# EasyEDA Pro project ProPrj_Sierra Wireless M2 Carrier_2026-07-14.epro

# Schematic Schematic1
Board Name: Board1; Create Date: 2026-07-10; Page Name: P1; Project Name: Sierra Wireless M2 Carrier; Schematic Name: Schematic1; Update Date: 2026-07-10; Company: EasyEDA.com; Page Size: A4; Version: V1.0
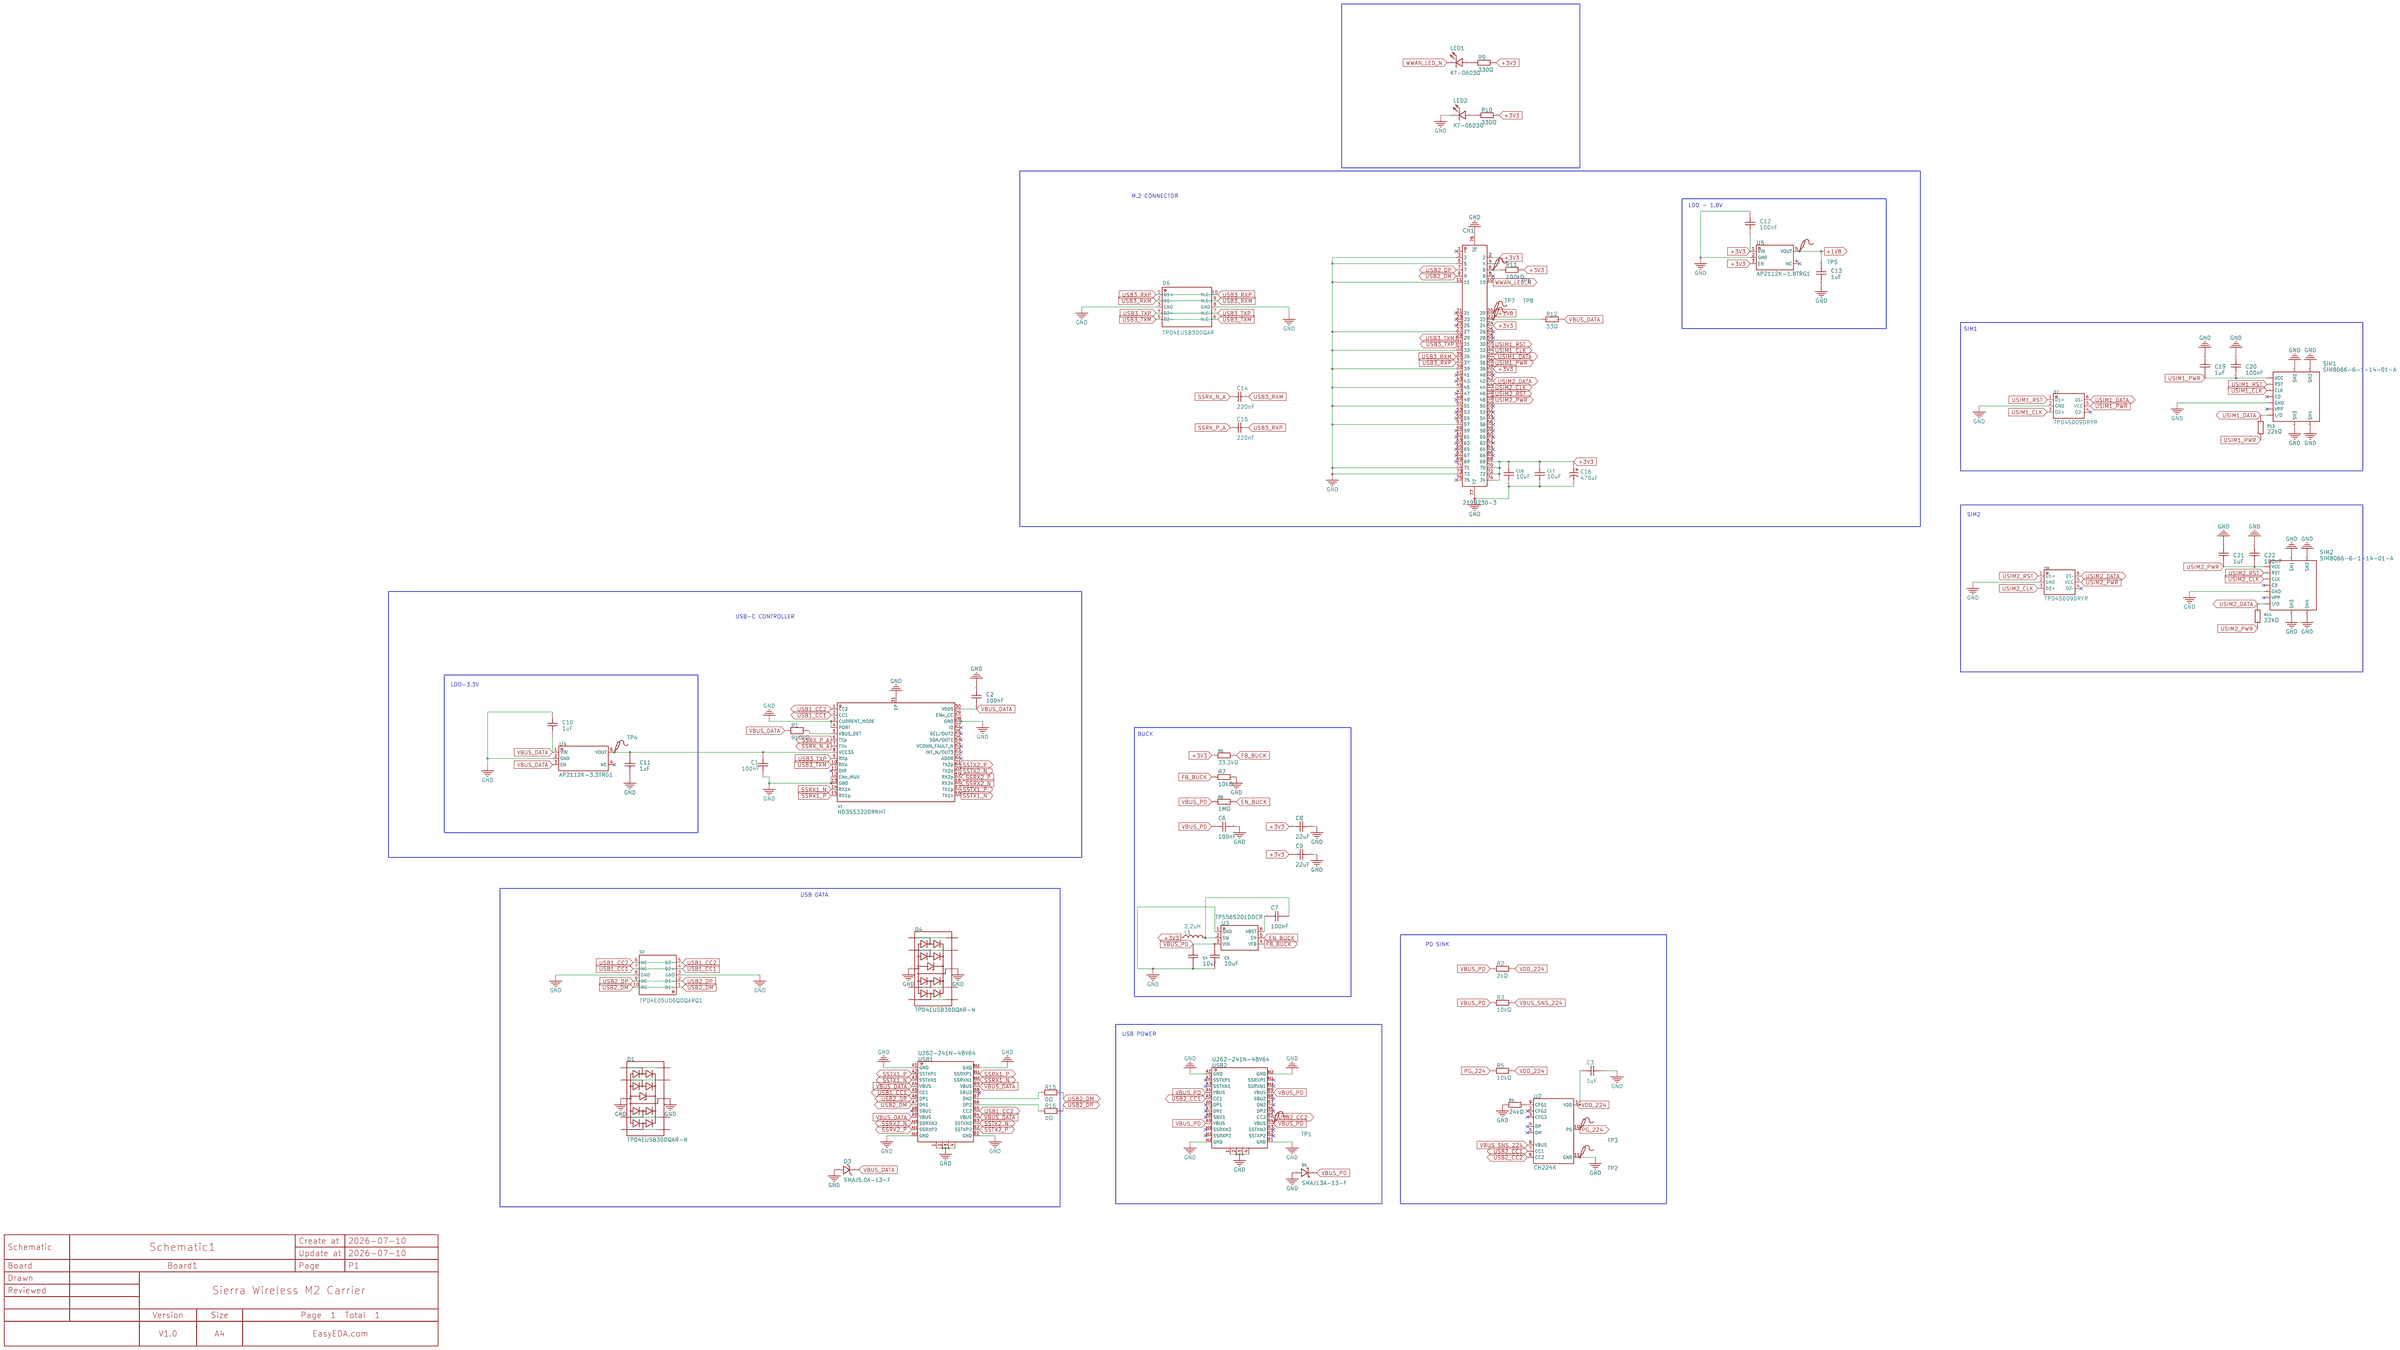
[diagram p0: schematic sheet]

## Parts
C1  100nF  [C0603]
C2  100nF  [C0603]
C3  1uF  [C0603]
C4  10uF  [C0603]
C5  10uF  [C0603]
C6  100nF  [C0402]
C7  100nF  [C0402]
C8  22uF  [C0603]
C9  22uF  [C0603]
C10  1uF  [C0603]
C11  1uF  [C0603]
C12  100nF  [C0402]
C13  1uF  [C0603]
C14  220nF  [C0603]
C15  220nF  [C0603]
C16  470uF  [CAP-TH_BD8.0-P3.50-D0.5-FD]
C17  10uF  [C0603]
C18  10uF  [C0603]
C19  1uF  [C0603]
C20  100nF  [C0402]
C21  1uF  [C0603]
C22  100nF  [C0402]
CN1  2199230-3  [PCIE-SMD_2199230-3_1]
D1  TPD4EUSB30DQAR-N  [DFN-10_L2.5-W1.0-P0.50-BL-A]
D2  TPD4E05U06QDQARQ1  [USON-10_L2.5-W1.0-P0.50-BL]
D3  SMAJ5.0A-13-F  [SMA_L4.3-W2.6-LS5.2-RD]
D4  TPD4EUSB30DQAR-N  [DFN-10_L2.5-W1.0-P0.50-BL-A]
D5  SMAJ13A-13-F  [SMA_L4.4-W2.6-LS5.0-RD]
D6  TPD4EUSB30DQAR  [USON-10_L2.5-W1.0-P0.50-BL]
D7  TPD4S009DRYR  [SON-6_L1.5-W1.0-P0.50-TL]
D8  TPD4S009DRYR  [SON-6_L1.5-W1.0-P0.50-TL]
L1  2.2uH  [IND-SMD_L4.0-W4.0_YHNR4020]
LED1  KT-0603G  [LED0603-RD]
LED2  KT-0603G  [LED0603-RD]
R1  910kΩ  [R0402]
R2  2kΩ  [R0805]
R3  10kΩ  [R0603]
R4  24kΩ  [R0603]
R5  10kΩ  [R0603]
R6  33.2kΩ  [R0603]
R7  10kΩ  [R0603]
R8  1MΩ  [R0603]
R9  330Ω  [R0603]
R10  330Ω  [R0603]
R11  100kΩ  [R0603]
R12  33Ω  [R0603]
R13  22kΩ  [R0603]
R14  22kΩ  [R0603]
R15  0Ω  [R0603]
R16  0Ω  [R0603]
SIM1  SIM8066-6-1-14-01-A  [SIM-SMD_SIM8066-6-1-14-01-A]
SIM2  SIM8066-6-1-14-01-A  [SIM-SMD_SIM8066-6-1-14-01-A]
TP1  -  [Test-Point-0.5mm]
TP2  -  [Test-Point-0.5mm]
TP3  -  [Test-Point-0.5mm]
TP4  -  [Test-Point-0.5mm]
TP5  -  [Test-Point-0.5mm]
TP6  -  [Test-Point-0.5mm]
TP7  -  [Test-Point-0.5mm]
TP8  -  [Test-Point-0.5mm]
U1  HD3SS3220RNHT  [WQFN-30_L4.5-W2.5-P0.4-BL-EP]
U2  CH224K  [ESSOP-10_L4.9-W3.9-P1.0-LS6.0-TL-EP]
U3  TPS565201DDCR  [SOT-23-6_L2.9-W1.6-P0.95-LS2.8-BR]
U4  AP2112K-3.3TRG1  [SOT-25-5_L2.9-W1.6-P0.95-LS2.8-BL]
U5  AP2112K-1.8TRG1  [SOT-25_L3.0-W1.6-P0.95-LS2.8-BL]
USB1  U262-241N-4BV64  [USB-C-SMD_TYC-324G]
USB2  U262-241N-4BV64  [USB-C-SMD_TYC-324G]

## Library data of the parts
C1 C2 = CAP_0603: Supplier Footprint: 0603
C3 C10 C11 C13 C19 C21 = CL10A105KB8NNNC: Capacitance:1uF Tolerance:±10% Tolerance:±10% Voltage Rating:50V Temperature Coefficient:X5R; LCSC Part Name: 1uF ±10% 50V; Supplier Part: C15849; Manufacturer: SAMSUNG(三星); Supplier Footprint: 0603; JLCPCB Part Class: Basic Part; Datasheet: https://item.szlcsc.com/datasheet/CL10A105KB8NNNC/16531.html; Supplier: LCSC; Tolerance: ±10%; Voltage Rating: 50V; Temperature Coefficient: X5R
C4 C5 C17 C18 = CL10A106MA8NRNC: Capacitance:10uF Tolerance:±20% Tolerance:±20% Voltage Rating:25V Temperature Coefficient:X5R; LCSC Part Name: 10uF ±20% 25V; Supplier Part: C96446; Manufacturer: SAMSUNG(三星); Supplier Footprint: 0603; JLCPCB Part Class: Basic Part; Datasheet: https://item.szlcsc.com/datasheet/CL10A106MA8NRNC/97651.html; Supplier: LCSC; Tolerance: ±20%; Voltage Rating: 25V; Temperature Coefficient: X5R
C6 C7 C12 C20 C22 = CL05B104KB54PNC: Capacitance:100nF Tolerance:±10% Tolerance:±10% Voltage Rating:50V Temperature Coefficient:X7R; LCSC Part Name: 100nF ±10% 50V; Supplier Part: C307331; Manufacturer: SAMSUNG(三星); Supplier Footprint: 0402; JLCPCB Part Class: Basic Part; Datasheet: https://item.szlcsc.com/datasheet/CL05B104KB54PNC/291005.html; Supplier: LCSC; Tolerance: ±10%; Voltage Rating: 50V; Temperature Coefficient: X7R
C8 C9 = CL10A226MP8NUNE: Capacitance:22uF Tolerance:±20% Tolerance:±20% Voltage Rating:10V Temperature Coefficient:X5R; LCSC Part Name: 22uF ±20% 10V; Supplier Part: C86295; Manufacturer: SAMSUNG(三星); Supplier Footprint: 0603; JLCPCB Part Class: Extended Part; Datasheet: https://item.szlcsc.com/datasheet/CL10A226MP8NUNE/87471.html; Supplier: LCSC; Tolerance: ±20%; Voltage Rating: 10V; Temperature Coefficient: X5R
C14 C15 = CL10B224KB8NNNC: Capacitance:220nF Tolerance:±10% Tolerance:±10% Voltage Rating:50V Temperature Coefficient:X7R; LCSC Part Name: 220nF ±10% 50V; Supplier Part: C64705; Manufacturer: SAMSUNG(三星); Supplier Footprint: 0603; JLCPCB Part Class: Extended Part; Datasheet: https://item.szlcsc.com/datasheet/CL10B224KB8NNNC/65773.html; Supplier: LCSC; Tolerance: ±10%; Voltage Rating: 50V; Temperature Coefficient: X7R
C16 = 03EC0575: Capacitance:470uF Tolerance:±20% Tolerance:±20% Voltage Rating:25V Ripple Current:470mA@100kHz Equivalent Series Resistance(ESR):400mΩ@100kHz Pin Spacing:3.5mm Diameter:8mm Height - Seated (Max):12mm Lifetime:8000hrs@105℃ Operating Temperature:-55℃~+105℃; LCSC Part Name: 470uF ±20% 25V; Supplier Part: C2831775; Manufacturer: KNSCHA(科尼盛); Supplier Footprint: 插件,D8xL12mm; JLCPCB Part Class: Extended Part; Datasheet: https://item.szlcsc.com/datasheet/03EC0575/2987114.html; Supplier: LCSC; Tolerance: ±20%; Voltage Rating: 25V; Ripple Current: 470mA@100kHz; Equivalent Series Resistance(ESR): 400mΩ@100kHz; Pin Spacing: 3.5mm; Diameter: 8mm; Height - Seated (Max): 12mm; Lifetime: 8000hrs@105℃; Operating Temperature: -55℃~+105℃
CN1 = 2199230-3: Interface Form:M.2-B Key Connector Type:Female Number of Pins:67P Mounting Type:Surface Mount, Right Angle Height Above Board:4.2mm Supplementary Features:with locating pin Operating Temperature:- Operating Temperature:-; Supplier Part: C590859; Manufacturer: TE Connectivity(泰科电子); Supplier Footprint: SMD,P=0.5mm,卧贴; JLCPCB Part Class: Extended Part; Datasheet: https://item.szlcsc.com/datasheet/2199230-3/618723.html; Supplier: LCSC; Interface Form: M.2-B Key; Connector Type: Female; Number of Pins: 67P; Mounting Type: Surface Mount, Right Angle; Height Above Board: 4.2mm; Supplementary Features: with locating pin
D1 D4 = TPD4EUSB30DQAR-N: Polarity:Unidirectional Reverse Stand-Off Voltage (Vrwm):5V Clamping Voltage:10V Peak Pulse Current (Ipp):3.5A@8/20us Peak Pulse Power Dissipation (Ppp):60W@8/20us Voltage - Breakdown:7.8V Reverse Leakage Current (Ir):500nA level of protection:IEC 61000-4; LCSC Part Name: 单向ESD 5V截止 峰值浪涌电流：3.5A@8/20us; Supplier Part: C5148477; Manufacturer: BORN(伯恩半导体); Supplier Footprint: DFN-10(2.5x1.0); JLCPCB Part Class: Extended Part; Datasheet: https://item.szlcsc.com/datasheet/TPD4EUSB30DQAR-N/5771546.html; Supplier: LCSC; Polarity: Unidirectional; Reverse Stand-Off Voltage (Vrwm): 5V; Clamping Voltage: 10V; Peak Pulse Current (Ipp): 3.5A@8/20us; Peak Pulse Power Dissipation (Ppp): 60W@8/20us; Voltage - Breakdown: 7.8V; Reverse Leakage Current (Ir): 500nA; level of protection: IEC 61000-4-4；IEC 61000-4-5；IEC 61000-4-2; Type: ESD; Junction Capacitance: 0.3pF
D2 = TPD4E05U06QDQARQ1: Polarity:Unidirectional Reverse Stand-Off Voltage (Vrwm):5.5V Clamping Voltage:14V Peak Pulse Current (Ipp):2.5A@8/20us Peak Pulse Power Dissipation (Ppp):40W@8/20us Voltage - Breakdown:8.7V Reverse Leakage Current (Ir):10nA Number of Channels:Four channe; LCSC Part Name: 单向ESD 5.5V截止 峰值脉冲电流：2.5A@8/20us; Supplier Part: C81353; Manufacturer: TI(德州仪器); Supplier Footprint: USON-10(1x2.5); JLCPCB Part Class: Extended Part; Datasheet: https://www.ti.com/cn/lit/ds/symlink/tpd4e05u06-q1.pdf; Supplier: LCSC; Polarity: Unidirectional; Reverse Stand-Off Voltage (Vrwm): 5.5V; Clamping Voltage: 14V; Peak Pulse Current (Ipp): 2.5A@8/20us; Peak Pulse Power Dissipation (Ppp): 40W@8/20us; Voltage - Breakdown: 8.7V; Reverse Leakage Current (Ir): 10nA; Number of Channels: Four channels; Operating Temperature: -40℃~+125℃; level of protection: IEC 61000-4-4；IEC 61000-4-5；IEC 61000-4-2; Type: ESD; Junction Capacitance: 0.5pF
D3 = SMAJ5.0A-13-F: Polarity:Unidirectional Reverse Stand-Off Voltage (Vrwm):5V Clamping Voltage:9.2V Peak Pulse Current (Ipp):43.5A Peak Pulse Power Dissipation (Ppp):400W Voltage - Breakdown:6.4V Reverse Leakage Current (Ir):800uA Operating Temperature:-55℃~+150℃ Operating; LCSC Part Name: 单向TVS 5V截止 峰值脉冲电流：43.5A; Supplier Part: C87074; Manufacturer: DIODES(美台); Supplier Footprint: SMA; JLCPCB Part Class: Extended Part; Datasheet: https://item.szlcsc.com/datasheet/SMAJ5.0A-13-F/88252.html; Supplier: LCSC; Polarity: Unidirectional; Reverse Stand-Off Voltage (Vrwm): 5V; Clamping Voltage: 9.2V; Peak Pulse Current (Ipp): 43.5A; Peak Pulse Power Dissipation (Ppp): 400W; Voltage - Breakdown: 6.4V; Reverse Leakage Current (Ir): 800uA; Operating Temperature: -55℃~+150℃; Type: TVS
D5 = SMAJ13A-13-F: Polarity:Unidirectional Reverse Stand-Off Voltage (Vrwm):13V Clamping Voltage:21.5V Peak Pulse Current (Ipp):18.6A Peak Pulse Power Dissipation (Ppp):400W Voltage - Breakdown:15.9V Reverse Leakage Current (Ir):5uA Operating Temperature:-55℃~+150℃ Operatin; LCSC Part Name: 单向TVS 13V截止 峰值脉冲电流：18.6A; Supplier Part: C110519; Manufacturer: DIODES(美台); Supplier Footprint: SMA; JLCPCB Part Class: Extended Part; Datasheet: https://item.szlcsc.com/datasheet/SMAJ13A-13-F/111742.html; Supplier: LCSC; Polarity: Unidirectional; Reverse Stand-Off Voltage (Vrwm): 13V; Clamping Voltage: 21.5V; Peak Pulse Current (Ipp): 18.6A; Peak Pulse Power Dissipation (Ppp): 400W; Voltage - Breakdown: 15.9V; Reverse Leakage Current (Ir): 5uA; Operating Temperature: -55℃~+150℃; Type: TVS
D6 = TPD4EUSB30DQAR: Polarity:Unidirectional Reverse Stand-Off Voltage (Vrwm):5.5V Clamping Voltage:8V Peak Pulse Current (Ipp):5A@8/20us Peak Pulse Power Dissipation (Ppp):45W@8/20us Voltage - Breakdown:7V Number of Channels:4 Operating Temperature:-40℃~+85℃ Operating Temper; LCSC Part Name: 单向ESD 5.5V截止 峰值脉冲电流：5A@8/20us; Supplier Part: C90627; Manufacturer: TI(德州仪器); Supplier Footprint: USON-10(1x2.5); JLCPCB Part Class: Extended Part; Datasheet: https://www.ti.com/cn/lit/gpn/tpd4eusb30; Supplier: LCSC; Polarity: Unidirectional; Reverse Stand-Off Voltage (Vrwm): 5.5V; Clamping Voltage: 8V; Peak Pulse Current (Ipp): 5A@8/20us; Peak Pulse Power Dissipation (Ppp): 45W@8/20us; Voltage - Breakdown: 7V; Number of Channels: 4; Operating Temperature: -40℃~+85℃; level of protection: IEC 61000-4-5；IEC 61000-4-2; Type: ESD; Junction Capacitance: 0.8pF
D7 D8 = TPD4S009DRYR: Reverse Stand-Off Voltage (Vrwm):5.5V Peak Pulse Current (Ipp):2.5A@8/20us Peak Pulse Power Dissipation (Ppp):25W@8/20us Voltage - Breakdown:9V Reverse Leakage Current (Ir):100nA Number of Channels:4 Operating Temperature:-40℃~+85℃ Operating Temperature:-; LCSC Part Name: 5.5V 2.5A@8/20us; Supplier Part: C544670; Manufacturer: TI(德州仪器); Supplier Footprint: SON-6(1x1.5); JLCPCB Part Class: Extended Part; Datasheet: https://www.ti.com/cn/lit/gpn/tpd4s010; Supplier: LCSC; Reverse Stand-Off Voltage (Vrwm): 5.5V; Peak Pulse Current (Ipp): 2.5A@8/20us; Peak Pulse Power Dissipation (Ppp): 25W@8/20us; Voltage - Breakdown: 9V; Reverse Leakage Current (Ir): 100nA; Number of Channels: 4; Operating Temperature: -40℃~+85℃; level of protection: IEC 61000-4-2; Type: TVS; Junction Capacitance: 0.8pF
L1 = YHNR4020-2R2M: Inductance: Tolerance:±20% Tolerance:±20% Current Rating: Current - Saturation(Isat):6A DC Resistance(DCR): Ratings:-; LCSC Part Name: 2.2uH ±20% 6A; Supplier Part: C2926400; Manufacturer: YJYCOIN(益嘉源); Supplier Footprint: SMD,4x4x2mm; JLCPCB Part Class: Extended Part; Datasheet: https://atta.szlcsc.com/upload/public/pdf/source/20211202/92B62577A64ED0AE2920F9EB9C7C514D.pdf; Supplier: LCSC; Tolerance: ±20%; Current - Saturation(Isat): 6A
LED1 LED2 = KT-0603G: Lamp Holder Type:1.6mm x 0.8mm square LED Illumination Color:Emerald Green Voltage - Forward(Vf):3.1V Voltage - Forward(Vf):3.1V Power(Watts):100mW Forward Current:5mA Wavelength - Dominant:513nm~528nm Wavelength - Dominant:513nm~528nm Peak Wavelength:525; LCSC Part Name: 0603 翠绿 高亮; Supplier Part: C12624; Manufacturer: KENTO; Supplier Footprint: 0603; JLCPCB Part Class: Extended Part; Datasheet: https://item.szlcsc.com/datasheet/KT-0603G/13258.html; Supplier: LCSC; Lamp Holder Type: 1.6mm x 0.8mm square LED; Illumination Color: Emerald Green; Voltage - Forward(Vf): 3.1V; Power(Watts): 100mW; Forward Current: 5mA; Wavelength - Dominant: 513nm~528nm; Peak Wavelength: 525nm; Diode Configuration: Discrete Diode; Lens Color: Water Clear; Luminous Intensity: 430mcd; Viewing Angle: 120°; Operating Temperature: -40℃~+85℃
R1 = FRC0402F9103TS: Type:Thick Film Resistor Resistance:910kΩ Tolerance:±1% Tolerance:±1% Power(Watts):62.5mW Voltage-Supply(Max):50V Temperature Coefficient:±100ppm/℃ Temperature Coefficient:±100ppm/℃ Operating Temperature:-55℃~+155℃ Operating Temperature:-55℃~+155℃; LCSC Part Name: 910kΩ ±1% 62.5mW 厚膜电阻; Supplier Part: C2909391; Manufacturer: FOJAN(富捷); Supplier Footprint: 0402; JLCPCB Part Class: Extended Part; Datasheet: https://item.szlcsc.com/datasheet/FRC0402F9103TS/3186326.html; Supplier: LCSC; Type: Thick Film Resistor; Tolerance: ±1%; Power(Watts): 62.5mW; Voltage-Supply(Max): 50V; Temperature Coefficient: ±100ppm/℃; Operating Temperature: -55℃~+155℃
R2 = 0805W8J0202T5E: Type:Thick Film Resistors Resistance:2kΩ Tolerance:±5% Tolerance:±5% Power(Watts): Overload Voltage (Max): Temperature Coefficient:±100ppm/℃ Temperature Coefficient:±100ppm/℃ Operating Temperature Range:-55℃~+155℃ Operating Temperature Range:-55℃~+155℃; LCSC Part Name: 2kΩ ±5% 125mW 厚膜电阻; Supplier Part: C1359; Manufacturer: UNI-ROYAL(厚声); Supplier Footprint: 0805; JLCPCB Part Class: Extended Part; Datasheet: https://atta.szlcsc.com/upload/public/pdf/source/20200306/C422600_1E6D84923E4A46A82E41ADD87F860B5C.pdf; Supplier: LCSC; Type: Thick Film Resistors; Tolerance: ±5%; Temperature Coefficient: ±100ppm/℃; Operating Temperature Range: -55℃~+155℃
R3 R5 R7 = RC0603FR-0710KL: Type:Thick Film Resistor Resistance:10kΩ Tolerance:±1% Tolerance:±1% Power(Watts):100mW Voltage-Supply(Max):75V Temperature Coefficient:±100ppm/℃ Temperature Coefficient:±100ppm/℃ Operating Temperature:-55℃~+155℃ Operating Temperature:-55℃~+155℃; LCSC Part Name: 厚膜电阻 10kΩ ±1% 100mW; Supplier Part: C98220; Manufacturer: YAGEO(国巨); Supplier Footprint: 0603; JLCPCB Part Class: Extended Part; Datasheet: https://item.szlcsc.com/datasheet/RC0603FR-0710KL/99429.html; Supplier: LCSC; Type: Thick Film Resistor; Tolerance: ±1%; Power(Watts): 100mW; Voltage-Supply(Max): 75V; Temperature Coefficient: ±100ppm/℃; Operating Temperature: -55℃~+155℃
R4 = 0603WAF2402T5E: Type:Thick Film Resistor Resistance:24kΩ Tolerance:±1% Tolerance:±1% Power(Watts):100mW Voltage-Supply(Max):75V Temperature Coefficient:±100ppm/℃ Temperature Coefficient:±100ppm/℃ Operating Temperature:-55℃~+155℃ Operating Temperature:-55℃~+155℃; LCSC Part Name: 24kΩ ±1% 100mW 厚膜电阻; Supplier Part: C23352; Manufacturer: UNI-ROYAL(厚声); Supplier Footprint: 0603; JLCPCB Part Class: Basic Part; Datasheet: https://item.szlcsc.com/datasheet/0603WAF2402T5E/24085.html; Supplier: LCSC; Type: Thick Film Resistor; Tolerance: ±1%; Power(Watts): 100mW; Voltage-Supply(Max): 75V; Temperature Coefficient: ±100ppm/℃; Operating Temperature: -55℃~+155℃
R6 = RMC060333.2K1%N: Type:Thick Film Resistor Resistance:33.2kΩ Tolerance:±1% Tolerance:±1% Power(Watts):100mW Voltage-Supply(Max):50V Temperature Coefficient:±100ppm/℃ Temperature Coefficient:±100ppm/℃ Operating Temperature:-55℃~+155℃ Operating Temperature:-55℃~+155℃; LCSC Part Name: 33.2kΩ ±1% 100mW; Supplier Part: C325687; Manufacturer: Tyohm(幸亚电阻); Supplier Footprint: 0603; JLCPCB Part Class: Extended Part; Datasheet: https://item.szlcsc.com/datasheet/RMC060333.2K1%2525N/305892.html; Supplier: LCSC; Type: Thick Film Resistor; Tolerance: ±1%; Power(Watts): 100mW; Voltage-Supply(Max): 50V; Temperature Coefficient: ±100ppm/℃; Operating Temperature: -55℃~+155℃
R8 = 0603WAF1004T5E: Type:Thick Film Resistor Resistance:1MΩ Tolerance:±1% Tolerance:±1% Power(Watts):100mW Voltage-Supply(Max):75V Temperature Coefficient:±100ppm/℃ Temperature Coefficient:±100ppm/℃ Operating Temperature:-55℃~+155℃ Operating Temperature:-55℃~+155℃; LCSC Part Name: 1MΩ ±1% 100mW 厚膜电阻; Supplier Part: C22935; Manufacturer: UNI-ROYAL(厚声); Supplier Footprint: 0603; JLCPCB Part Class: Basic Part; Datasheet: https://item.szlcsc.com/datasheet/0603WAF1004T5E/23662.html; Supplier: LCSC; Type: Thick Film Resistor; Tolerance: ±1%; Power(Watts): 100mW; Voltage-Supply(Max): 75V; Temperature Coefficient: ±100ppm/℃; Operating Temperature: -55℃~+155℃
R9 R10 = 0603WAF3300T5E: Type:Thick Film Resistors Resistance: Tolerance:±1% Tolerance:±1% Power(Watts): Overload Voltage (Max): Temperature Coefficient:±100ppm/℃ Temperature Coefficient:±100ppm/℃ Operating Temperature Range:-55℃~+155℃ Operating Temperature Range:-55℃~+155℃; LCSC Part Name: 330Ω ±1% 100mW 厚膜电阻; Supplier Part: C23138; Manufacturer: UNI-ROYAL(厚声); Supplier Footprint: 0603; JLCPCB Part Class: Basic Part; Datasheet: https://atta.szlcsc.com/upload/public/pdf/source/20200306/C422600_1E6D84923E4A46A82E41ADD87F860B5C.pdf; Supplier: LCSC; Type: Thick Film Resistors; Tolerance: ±1%; Temperature Coefficient: ±100ppm/℃; Operating Temperature Range: -55℃~+155℃
R11 = 0603WAF1003T5E: Type:Thick Film Resistor Resistance:100kΩ Tolerance:±1% Tolerance:±1% Power(Watts):100mW Voltage-Supply(Max):75V Temperature Coefficient:±100ppm/℃ Temperature Coefficient:±100ppm/℃ Operating Temperature:-55℃~+155℃ Operating Temperature:-55℃~+155℃; LCSC Part Name: 100kΩ ±1% 100mW 厚膜电阻; Supplier Part: C25803; Manufacturer: UNI-ROYAL(厚声); Supplier Footprint: 0603; JLCPCB Part Class: Basic Part; Datasheet: https://item.szlcsc.com/datasheet/0603WAF1003T5E/26546.html; Supplier: LCSC; Type: Thick Film Resistor; Tolerance: ±1%; Power(Watts): 100mW; Voltage-Supply(Max): 75V; Temperature Coefficient: ±100ppm/℃; Operating Temperature: -55℃~+155℃
R12 = 0603WAF330JT5E: Type:Thick Film Resistor Resistance:33Ω Tolerance:±1% Tolerance:±1% Power(Watts):100mW Voltage-Supply(Max):75V Temperature Coefficient:±100ppm/℃ Temperature Coefficient:±100ppm/℃ Operating Temperature:-55℃~+155℃ Operating Temperature:-55℃~+155℃; LCSC Part Name: 33Ω ±1% 100mW 厚膜电阻; Supplier Part: C23140; Manufacturer: UNI-ROYAL(厚声); Supplier Footprint: 0603; JLCPCB Part Class: Basic Part; Datasheet: https://item.szlcsc.com/datasheet/0603WAF330JT5E/23867.html; Supplier: LCSC; Type: Thick Film Resistor; Tolerance: ±1%; Power(Watts): 100mW; Voltage-Supply(Max): 75V; Temperature Coefficient: ±100ppm/℃; Operating Temperature: -55℃~+155℃
R13 R14 = 0603WAF2202T5E: Type:Thick Film Resistor Resistance:22kΩ Tolerance:±1% Tolerance:±1% Power(Watts):100mW Voltage-Supply(Max):75V Temperature Coefficient:±100ppm/℃ Temperature Coefficient:±100ppm/℃ Operating Temperature:-55℃~+155℃ Operating Temperature:-55℃~+155℃; LCSC Part Name: 22kΩ ±1% 100mW 厚膜电阻; Supplier Part: C31850; Manufacturer: UNI-ROYAL(厚声); Supplier Footprint: 0603; JLCPCB Part Class: Basic Part; Datasheet: https://item.szlcsc.com/datasheet/0603WAF2202T5E/32812.html; Supplier: LCSC; Type: Thick Film Resistor; Tolerance: ±1%; Power(Watts): 100mW; Voltage-Supply(Max): 75V; Temperature Coefficient: ±100ppm/℃; Operating Temperature: -55℃~+155℃
R15 R16 = RC0603JR-070RL: Type:Thick Film Resistor Resistance:0Ω Tolerance:±5% Tolerance:±5% Power(Watts):100mW Voltage-Supply(Max):75V Temperature Coefficient:- Temperature Coefficient:- Operating Temperature:-55℃~+155℃ Operating Temperature:-55℃~+155℃; LCSC Part Name: 厚膜电阻 0Ω ±5% 100mW; Supplier Part: C95177; Manufacturer: YAGEO(国巨); Supplier Footprint: 0603; JLCPCB Part Class: Extended Part; Datasheet: https://item.szlcsc.com/datasheet/RC0603JR-070RL/96378.html; Supplier: LCSC; Type: Thick Film Resistor; Tolerance: ±5%; Power(Watts): 100mW; Voltage-Supply(Max): 75V; Operating Temperature: -55℃~+155℃
SIM1 SIM2 = SIM8066-6-1-14-01-A: Card Connection Mode:Push-Push Card Type:Nano-SIM Card Connector Type:Connector and Ejector Height Above Board:1.45mm Rated Voltage (Max):30V Operating Temperature:-40℃~+85℃ Operating Temperature:-40℃~+85℃; LCSC Part Name: 自弹式 NanoSIM卡 卡座; Supplier Part: C3032925; Manufacturer: GCT; Supplier Footprint: SMD; JLCPCB Part Class: Extended Part; Datasheet: https://item.szlcsc.com/datasheet/SIM8066-6-1-14-01-A/3573575.html; Supplier: LCSC; Card Connection Mode: Push-Push; Card Type: Nano-SIM Card; Connector Type: Connector and Ejector; Height Above Board: 1.45mm; Rated Voltage (Max): 30V; Operating Temperature: -40℃~+85℃
TP1-TP8 = Test-Point: Test Point 测试点
U1 = HD3SS3220RNHT: Number of Channels:2 Control Input Logic:Active Low；Active High RDS(on):8Ω Features:Overcurrent Protection Operating Temperature	-:-40℃~+85℃ Operating Temperature	-:-40℃~+85℃; LCSC Part Name: 具有超高速2:1MUX的USB Type-C DRP端口控制器; Supplier Part: C2155924; Manufacturer: TI(德州仪器); Supplier Footprint: WQFN-30-EP(2.5x4.5); JLCPCB Part Class: Extended Part; Datasheet: https://www.ti.com/cn/lit/ds/symlink/hd3ss3220.pdf; Supplier: LCSC; Number of Channels: 2; Control Input Logic: Active Low；Active High; RDS(on): 8Ω; Features: Overcurrent Protection; Operating Temperature	-: -40℃~+85℃
U2 = CH224K: Type:Power Receiver Controller Protocol:PD 3.0 Number of Channels:- Output Power:100W Output Voltage:5V；20V；15V；12V；9V Voltage - Supply:4V~30V Voltage - Supply:4V~30V Operating Temperature:-40℃~+90℃ Operating Temperature:-40℃~+90℃ Features:Thermal Protect; LCSC Part Name: USBPD等多快充协议受电芯片CH224; Supplier Part: C970725; Manufacturer: WCH(南京沁恒); Supplier Footprint: ESSOP-10-150mil-1mm; JLCPCB Part Class: Extended Part; Datasheet: https://item.szlcsc.com/datasheet/CH224K/1060460.html; Supplier: LCSC; Type: Power Receiver Controller; Protocol: PD 3.0; Output Power: 100W; Output Voltage: 5V；20V；15V；12V；9V; Voltage - Supply: 4V~30V; Operating Temperature: -40℃~+90℃; Features: Thermal Protection；Overvoltage protection
U3 = TPS565201DDCR: Function:Step-down type Voltage - Supply:4.5V~17V Voltage - Supply:4.5V~17V Output Voltage:760mV~7V Output Voltage:760mV~7V Output Current:5A Frequency - Switching:500kHz Frequency - Switching:500kHz Operating Temperature:-40℃~+125℃@(TJ) Operating Tempera; LCSC Part Name: 降压型 5A 4.5V~17V; Supplier Part: C327676; Manufacturer: TI(德州仪器); Supplier Footprint: TSOT-23-6; JLCPCB Part Class: Extended Part; Datasheet: https://www.ti.com.cn/cn/lit/ds/symlink/tps565201.pdf; Supplier: LCSC; Function: Step-down type; Voltage - Supply: 4.5V~17V; Output Voltage: 760mV~7V; Output Current: 5A; Frequency - Switching: 500kHz; Operating Temperature: -40℃~+125℃@(TJ); Synchronous Rectifier: Yes; Number of Outputs: 1; Topology: Buck; Quiescent Current: 320uA; Switch tube (built-in/external): Built-in; Output Type: Adjustable; Features: Light load efficient mode；Cycle-by-cycle current limiting；Hiccup current limiting
U4 = AP2112K-3.3TRG1: Output Configuration:Positive Voltage - Supply:6V Output Voltage:3.3V Output Voltage:3.3V Output Current:600mA Power Supply Rejection Ratio (PSRR):65dB@(1kHz) Voltage Dropout:250mV@(600mA) standby current:55uA Noise:50uVrms Features:Enable control；Short C; LCSC Part Name: 3.3V 600mA 6V; Supplier Part: C51118; Manufacturer: DIODES(美台); Supplier Footprint: SOT-25-5; JLCPCB Part Class: Extended Part; Datasheet: https://item.szlcsc.com/datasheet/AP2112K-3.3TRG1/52131.html; Supplier: LCSC; Output Configuration: Positive; Voltage - Supply: 6V; Output Voltage: 3.3V; Output Current: 600mA; Power Supply Rejection Ratio (PSRR): 65dB@(1kHz); Voltage Dropout: 250mV@(600mA); standby current: 55uA; Noise: 50uVrms; Features: Enable control；Short Circuit Protection；Output discharge；Over Current Protection；Thermal shutdown; Operating Temperature: -40℃~+85℃@(Ta); Output Type: Fixed; Number of Outputs: 1
U5 = AP2112K-1.8TRG1: Output Configuration:Positive Voltage - Supply:6V Output Voltage:1.8V Output Voltage:1.8V Output Current:600mA Power Supply Rejection Ratio (PSRR):65dB@(1kHz) Voltage Dropout:500mV@(600mA) standby current:55uA Noise:50uVrms Features:Enable control；Short C; LCSC Part Name: 1.8V 600mA 6V; Supplier Part: C176944; Manufacturer: DIODES(美台); Supplier Footprint: SOT-25; JLCPCB Part Class: Extended Part; Datasheet: https://item.szlcsc.com/datasheet/AP2112K-1.8TRG1/188335.html; Supplier: LCSC; Output Configuration: Positive; Voltage - Supply: 6V; Output Voltage: 1.8V; Output Current: 600mA; Power Supply Rejection Ratio (PSRR): 65dB@(1kHz); Voltage Dropout: 500mV@(600mA); standby current: 55uA; Noise: 50uVrms; Features: Enable control；Short Circuit Protection；Output discharge；Over Current Protection；Thermal shutdown; Operating Temperature: -40℃~+85℃@(Ta); Output Type: Fixed; Number of Outputs: 1
USB1 USB2 = U262-241N-4BV64: Connector Type:Type-C Protocol Standard:- Gender:Female Mounting Type:Surface Mount, Right Angle Number of Contacts:24P Number of Ports:1 Current Rating-Power:5A Connect-Disconnect Life:10,000 cycles Length:7.9mm Operating Temperature:-40℃~+85℃ Operating; LCSC Part Name: Type-C 母 卧贴; Supplier Part: C388660; Manufacturer: XKB Connection(中国星坤); Supplier Footprint: SMD; JLCPCB Part Class: Extended Part; Datasheet: https://item.szlcsc.com/datasheet/U262-241N-4BV64/363930.html; Supplier: LCSC; Connector Type: Type-C; Gender: Female; Mounting Type: Surface Mount, Right Angle; Number of Contacts: 24P; Number of Ports: 1; Current Rating-Power: 5A; Connect-Disconnect Life: 10,000 cycles; Length: 7.9mm; Operating Temperature: -40℃~+85℃

## Nets
+1V8: C13.2 CN1.20 TP5.1 TP7.1 U5.5(VOUT)
+3V3: C8.1 C9.1 C12.1 C16.1 C17.1 C18.1 CN1.2 CN1.4 CN1.24 CN1.38 CN1.68 CN1.70 CN1.72 CN1.74 L1.1 R6.1 R9.1 R10.1 R11.2 U5.1(VIN) U5.3(EN)
GND: C1.1 C2.2 C3.2 C4.2 C5.2 C6.2 C8.2 C9.2 C10.2 C11.1 C12.2 C13.1 C16.2 C17.2 C18.2 C19.1 C20.1 C21.1 C22.1 CN1.3 CN1.5 CN1.11 CN1.27 CN1.33 CN1.39 CN1.45 CN1.51 CN1.57 CN1.71 CN1.73 CN1.76 CN1.77 D1.3 D1.8 D2.3(GND) D2.8(GND) D3.2(A) D4.3 D4.8 D5.2(A) D6.3(GND) D6.8(GND) D7.2(GND) D8.2(GND) LED2.1(K) R4.1 R7.2 SIM1.5(GND) SIM1.SH1 SIM1.SH2 SIM1.SH3 SIM1.SH4 SIM2.5(GND) SIM2.SH1 SIM2.SH2 SIM2.SH3 SIM2.SH4 TP2.1 U1.3(CURRENT_MODE) U1.4(PORT) U1.12(ENn_MUX) U1.13(GND) U1.28(GND) U1.29(ENn_CC) U1.31(EP) U2.11(GND) U3.1(GND) U4.2(GND) U5.2(GND) USB1.1 USB1.2 USB1.3 USB1.4 USB1.A1(GND) USB1.A12(GND) USB1.B1(GND) USB1.B12(GND) USB2.1 USB2.2 USB2.3 USB2.4 USB2.A1(GND) USB2.A12(GND) USB2.B1(GND) USB2.B12(GND)
VBUS_DATA: C2.1 C10.1 D3.1(C) R1.1 R12.2 U1.30(VDD5) U4.1(VIN) U4.3(EN) USB1.A4(VBUS) USB1.A9(VBUS) USB1.B4(VBUS) USB1.B9(VBUS)
VBUS_PD: C4.1 C5.1 C6.1 D5.1(K) R2.1 R3.1 R8.1 TP1.1 U3.3(VIN) USB2.A4(VBUS) USB2.A9(VBUS) USB2.B4(VBUS) USB2.B9(VBUS)
VBUS_SNS_224: R3.2 U2.8(VBUS)
VDD_224: C3.1 R2.2 R5.2 U2.1(VDD)
EN_BUCK: R8.2 U3.5(EN)
FB_BUCK: R6.2 R7.1 U3.4(VFB)
PG_224: R5.1 TP3.1 U2.10(PG)
SSRX1_N: U1.14(RX1n) USB1.B10(SSRXN1)
SSRX1_P: U1.15(RX1p) USB1.B11(SSRXP1)
SSRX2_N: U1.18(RX2n) USB1.A10(SSRXN2)
SSRX2_P: U1.19(RX2p) USB1.A11(SSRXP2)
SSRX_N_A: C14.1 U1.7(TXn)
SSRX_P_A: C15.1 U1.6(TXp)
SSTX1_N: U1.16(TX1n) USB1.A3(SSTXN1)
SSTX1_P: U1.17(TX1p) USB1.A2(SSTXP1)
SSTX2_N: U1.20(TX2n) USB1.B3(SSTXN2)
SSTX2_P: U1.21(TX2p) USB1.B2(SSTXP2)
USB1_CC1: D2.4(D2+) D2.7(NC) U1.2(CC1) USB1.A5(CC1)
USB1_CC2: D2.5(D2-) D2.6(NC) U1.1(CC2) USB1.B5(CC2)
USB2_CC1: U2.7(CC1) USB2.A5(CC1)
USB2_CC2: U2.6(CC2) USB2.B5(CC2)
USB2_DM: CN1.9 D2.1(D1+) D2.10(NC) R15.2 USB1.A7(DN1)
USB2_DP: CN1.7 D2.2(D1-) D2.9(NC) R16.2 USB1.A6(DP1)
USB3_RXM: C14.2 CN1.35 D6.2(D1-) D6.9(N.C.)
USB3_RXP: C15.2 CN1.37 D6.1(D1+) D6.10(N.C.)
USB3_TXM: CN1.29 D6.5(D2-) D6.6(N.C.) U1.10(RXn)
USB3_TXP: CN1.31 D6.4(D2+) D6.7(N.C.) U1.9(RXp)
USIM1_CLK: CN1.32 D7.3(D2+) SIM1.3(CLK)
USIM1_DATA: CN1.34 D7.6(D1–) R13.2 SIM1.7(I/O)
USIM1_PWR: C19.2 C20.2 CN1.36 D7.5(VCC) R13.1 SIM1.1(VCC)
USIM1_RST: CN1.30 D7.1(D1+) SIM1.2(RST)
USIM2_CLK: CN1.44 D8.3(D2+) SIM2.3(CLK)
USIM2_DATA: CN1.42 D8.6(D1–) R14.2 SIM2.7(I/O)
USIM2_PWR: C21.2 C22.2 CN1.48 D8.5(VCC) R14.1 SIM2.1(VCC)
USIM2_RST: CN1.46 D8.1(D1+) SIM2.2(RST)
WWAN_LED_N: CN1.10 LED1.1(K)
$1N43: C7.2 U3.6(VBST)
$1N75: C1.2 C11.2 TP4.1 U1.8(VCC33) U4.5(VOUT)
$1N104: CN1.22 R12.1 TP8.1
$1N134: LED2.2(A) R10.2
$1N175: LED1.2(A) R9.2
$1N255: CN1.6 R11.1 TP6.1
$1N366: R1.2 U1.5(VBUS_DET)
$1N416: R4.2 U2.9(CFG1)
$1N418: C7.1 L1.2 U3.2(SW)
Net-(D1-1): D1.1 D1.10
Net-(D1-2): D1.2 D1.9
Net-(D1-4): D1.4 D1.7
Net-(D1-5): D1.5 D1.6
Net-(D4-1): D4.1 D4.10
Net-(D4-2): D4.2 D4.9
Net-(D4-4): D4.4 D4.7
Net-(D4-5): D4.5 D4.6
Net-(R15-1): R15.1 USB1.B7(DN2)
Net-(R16-1): R16.1 USB1.B6(DP2)

Not connected (* = marked no-connect by the designer): CN1 1* 8* 21* 23* 25* 26* 28* 40* 41* 43* 47* 49* 50* 52* 53* 54* 55* 56* 58* 59* 60* 61* 62* 63* 64* 65* 66* 67* 69* 75*; D7 4(D2–)*; D8 4(D2–)*; SIM1 6(VPP)* CD*; SIM2 6(VPP)* CD*; U1 11(DIR)* 22(ADDR)* 23(INT_N/OUT3)* 24(VCONN_FAULT_N)* 25(SDA/OUT1)* 26(SCL/OUT2)* 27(ID)*; U2 2(CFG2)* 3(CFG3)* 4(DP)* 5(DM)*; U4 4(NC)*; U5 4(NC)*; USB1 A8(SBU1)* B8(SBU2)*; USB2 A2(SSTXP1)* A3(SSTXN1)* A6(DP1)* A7(DN1)* A8(SBU1)* A10(SSRXN2)* A11(SSRXP2)* B2(SSTXP2)* B3(SSTXN2)* B6(DP2)* B7(DN2)* B8(SBU2)* B10(SSRXN1)* B11(SSRXP1)*

## Notes on the sheet
- M.2 CONNECTOR
- LDO - 1.8V
- SIM1
- SIM2
- USB-C CONTROLLER
- LDO-3.3V
- BUCK
- USB DATA
- PD SINK
- USB POWER

# Board PCB1
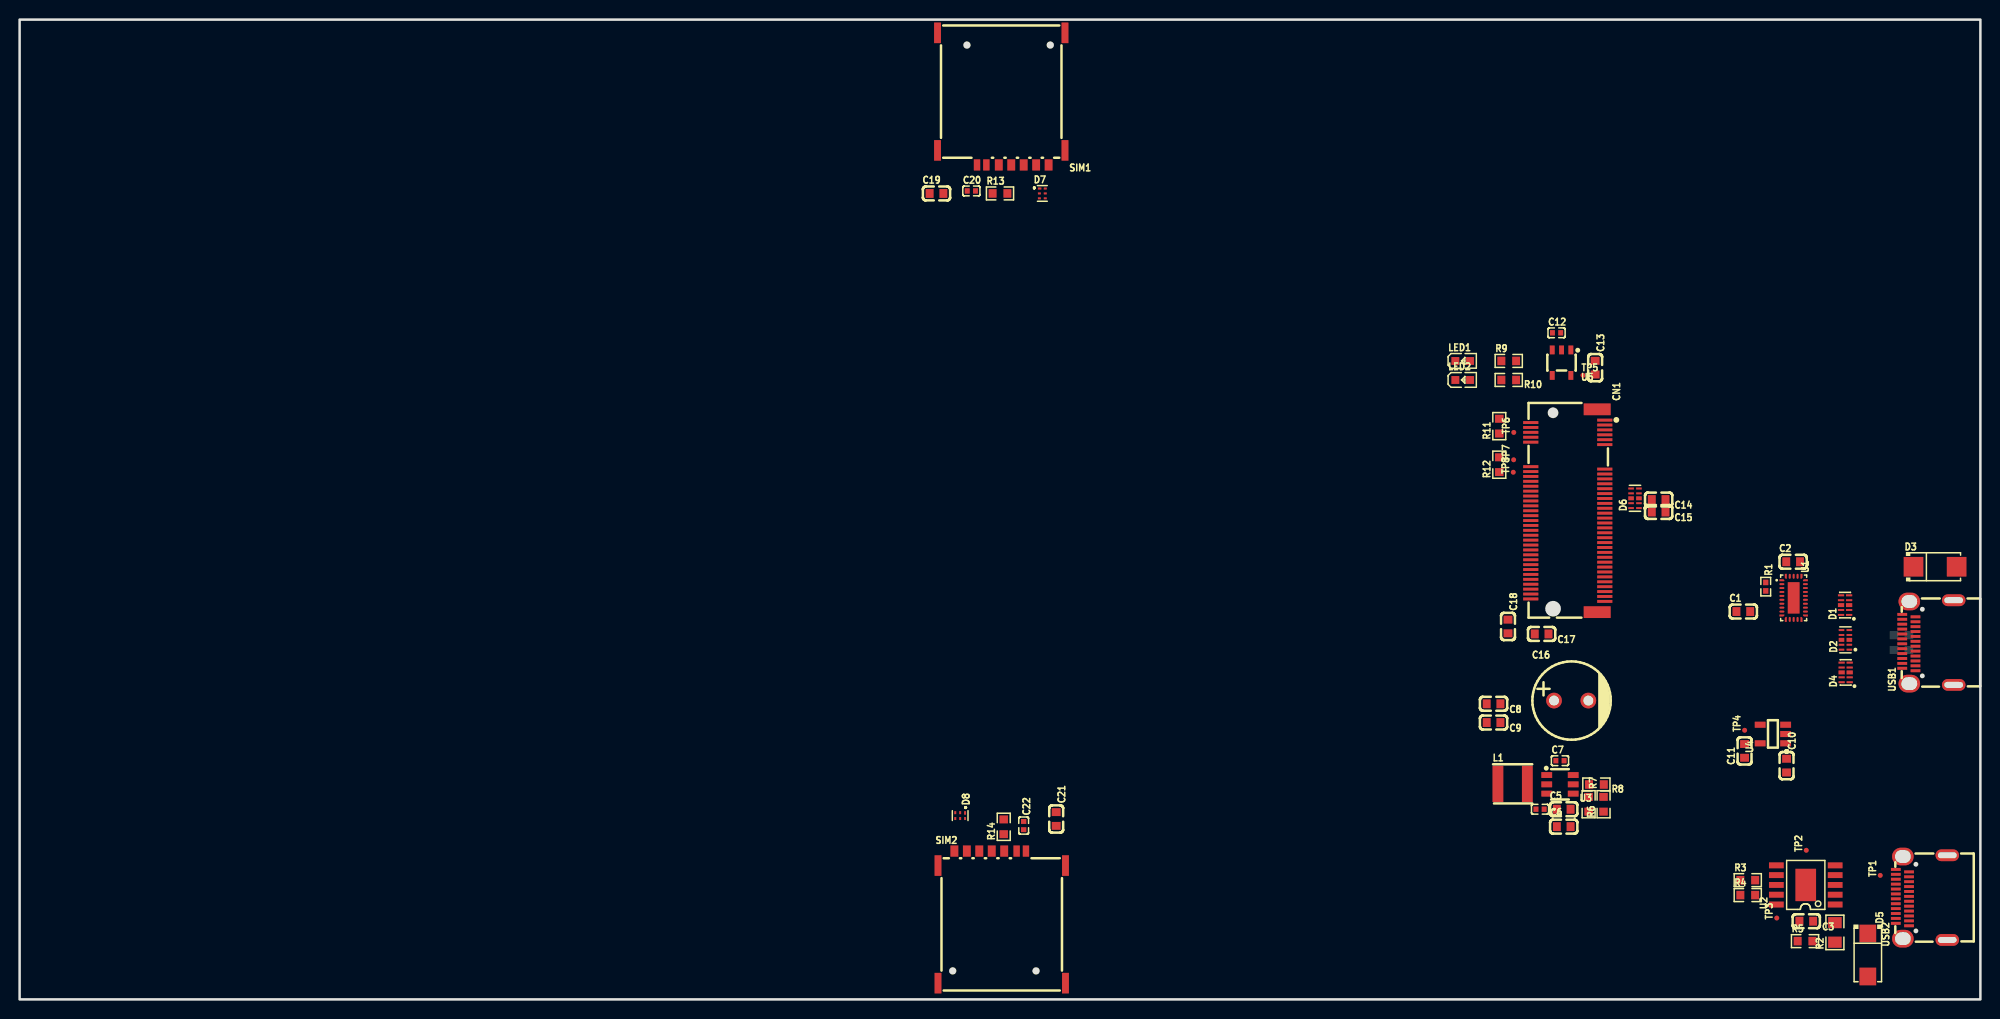
[diagram p1: board, top side]
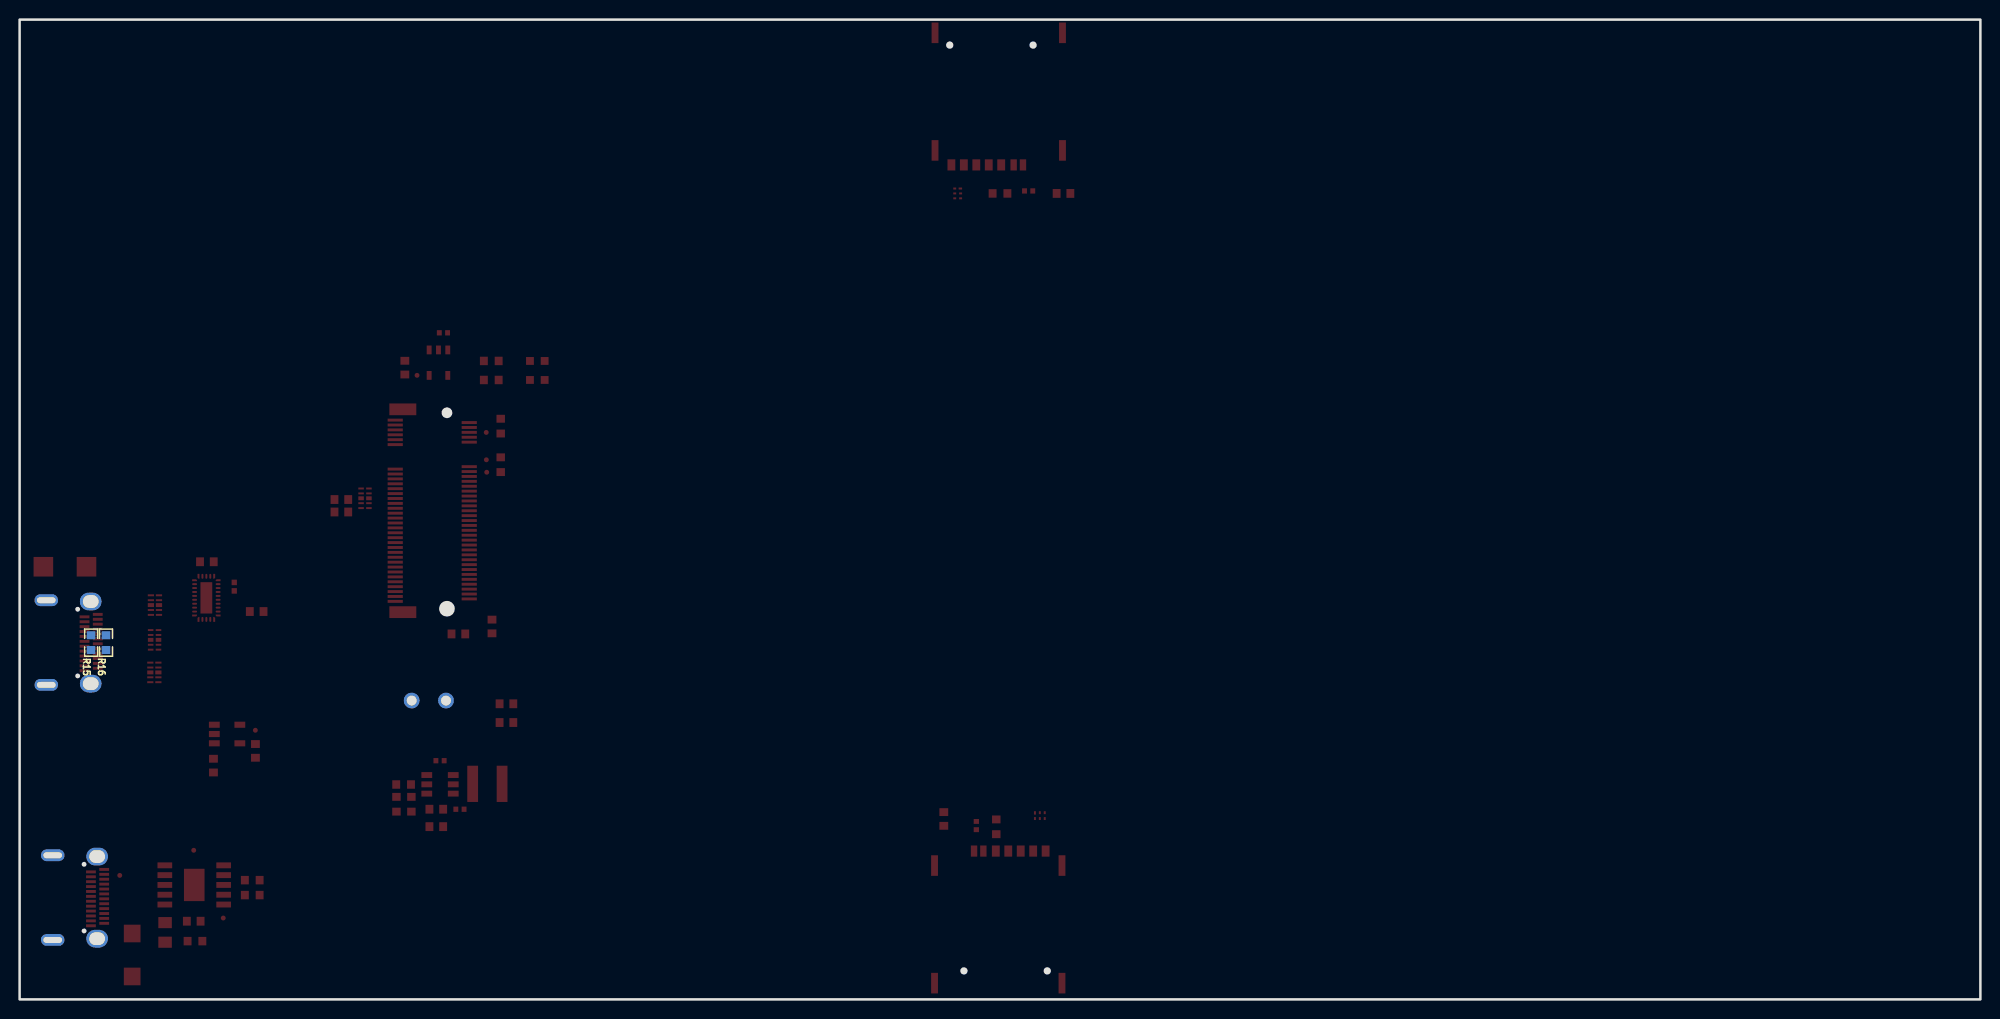
[diagram p2: board, bottom side, seen from below]

Outline 200 x 100 mm; copper layers: Top Layer, Inner1, Inner2, Bottom Layer. Coordinates in mm from the lower left corner of the outline.
Outline path: rectangle 0,0 200,100
Stack: Top Layer 0.035mm Outer layer thickness 1oz / Dielectric1 0.2104mm 7628 RC49% 8.6mil / Inner1 0.0152mm Inner layer thickness / Dielectric2 1.065mm 1.1mm H/HOZ Copper / Inner2 0.0152mm Inner layer thickness / Dielectric3 0.2104mm 7628 RC49% 8.6mil / Bottom Layer 0.035mm Outer layer thickness 1oz

## Design rules (mm)
net USB3_RXP: 90ohm, USB3_RX
net SSRX_P_A: 90ohm, DP1
net USB3_RXM: 90ohm, USB3_RX
net SSRX_N_A: 90ohm, DP1
net USB2_DM: 90ohm, USB2_D
net USB2_DP: 90ohm, USB2_D
net USB3_TXM: 90ohm, USB3_TX
net USB3_TXP: 90ohm, USB3_TX
net SSRX1_N: 90ohm, SSRX1_
net SSTX1_P: 90ohm, SSTX1_
net SSRX2_N: 90ohm, SSRX2_
net SSRX2_P: 90ohm, SSRX2_
net SSTX2_N: 90ohm, SSTX2_
net SSTX2_P: 90ohm, SSTX2_
net SSRX1_P: 90ohm, SSRX1_
net SSTX1_N: 90ohm, SSTX1_
spacing copperThickness1oz (default): track to track 0.102, other pairs 0.152 to 0.3
spacing copperThickness2oz: track to track 0.203, other pairs 0.152 to 0.3
spacing copperThicknessInner0.5oz: track to track 0.089, other pairs 0.152 to 0.3
track width copperThickness1oz (default): min 0.102, default 0.254, max 2.54
track width copperThickness2oz: min 0.203, default 0.254, max 2.54
track width copperThickness0.5oz: min 0.089, default 0.254, max 2.54
differential pair differentialPair (default): width min 0.127, default 0.254, max 2.54; gap min 0.152, default 0.152
net VBUS_PD uses copperRegion_copperThickness1oz
net GND uses copperRegion_copperThickness1oz
pour e302 uses copperRegion_default, default

## Placement (name value [footprint] x y rotation side)
C1  100nF  [C0603]  175.82 39.59 0 top
C2  100nF  [C0603]  180.9 44.67 0 top
C3  1uF  [C0603]  182.24 7.98 180 top
C4  10uF  [C0603]  157.5 17.63 0 top
C5  10uF  [C0603]  157.5 19.41 0 top
C6  100nF  [C0402]  155.09 19.41 180 top
C7  100nF  [C0402]  157.12 24.36 0 top
C8  22uF  [C0603]  150.34 30.17 180 top
C9  22uF  [C0603]  150.34 28.26 180 top
C10  1uF  [C0603]  180.23 23.86 270 top
C11  1uF  [C0603]  175.95 25.36 90 top
C12  100nF  [C0402]  156.77 68.03 0 top
C13  1uF  [C0603]  160.71 64.48 270 top
C14  220nF  [C0603]  167.18 51.02 180 top
C15  220nF  [C0603]  167.18 49.75 180 top
C16  470uF  [CAP-TH_BD8.0-P3.50-D0.5-FD]  158.26 30.5 0 top
C17  10uF  [C0603]  155.25 37.3 180 top
C18  10uF  [C0603]  151.82 38.06 270 top
C19  1uF  [C0603]  93.52 82.26 0 top
C20  100nF  [C0402]  97.08 82.51 0 top
C21  1uF  [C0603]  105.73 18.41 270 top
C22  100nF  [C0402]  102.41 17.74 270 top
CN1  2199230-3  [PCIE-SMD_2199230-3_1]  157.91 49.87 270 top
D1  TPD4EUSB30DQAR-N  [DFN-10_L2.5-W1.0-P0.50-BL-A]  186.2 40.24 90 top
D2  TPD4E05U06QDQARQ1  [USON-10_L2.5-W1.0-P0.50-BL]  186.23 36.7 90 top
D3  SMAJ5.0A-13-F  [SMA_L4.3-W2.6-LS5.2-RD]  195.38 44.16 0 top
D4  TPD4EUSB30DQAR-N  [DFN-10_L2.5-W1.0-P0.50-BL-A]  186.26 33.37 90 top
D5  SMAJ13A-13-F  [SMA_L4.4-W2.6-LS5.0-RD]  188.52 4.53 270 top
D6  TPD4EUSB30DQAR  [USON-10_L2.5-W1.0-P0.50-BL]  164.77 51.14 90 top
D7  TPD4S009DRYR  [SON-6_L1.5-W1.0-P0.50-TL]  104.32 82.26 0 top
D8  TPD4S009DRYR  [SON-6_L1.5-W1.0-P0.50-TL]  95.94 18.76 270 top
L1  2.2uH  [IND-SMD_L4.0-W4.0_YHNR4020]  152.29 22 0 top
LED1  KT-0603G  [LED0603-RD]  147.19 65.16 0 top
LED2  KT-0603G  [LED0603-RD]  147.19 63.22 0 top
R1  910kΩ  [R0402]  178.1 42.13 270 top
R2  2kΩ  [R0805]  185.16 6.84 90 top
R3  10kΩ  [R0603]  176.27 12.17 0 top
R4  24kΩ  [R0603]  176.27 10.65 0 top
R5  10kΩ  [R0603]  182.11 5.95 0 top
R6  33.2kΩ  [R0603]  161.56 19.92 90 top
R7  10kΩ  [R0603]  160.04 19.92 270 top
R8  1MΩ  [R0603]  160.83 21.93 180 top
R9  330Ω  [R0603]  151.89 65.16 0 top
R10  330Ω  [R0603]  151.89 63.22 180 top
R11  100kΩ  [R0603]  150.93 58.51 90 top
R12  33Ω  [R0603]  150.93 54.57 90 top
R13  22kΩ  [R0603]  100 82.26 0 top
R14  22kΩ  [R0603]  100.38 17.62 90 top
R15  0Ω  [R0603]  192.71 36.41 90 bottom
R16  0Ω  [R0603]  191.19 36.41 90 bottom
SIM1  SIM8066-6-1-14-01-A  [SIM-SMD_SIM8066-6-1-14-01-A]  100.13 91.91 180 top
SIM2  SIM8066-6-1-14-01-A  [SIM-SMD_SIM8066-6-1-14-01-A]  100.18 8.4 0 top
TP1  -  [Test-Point-0.5mm]  189.79 12.66 90 top
TP2  -  [Test-Point-0.5mm]  182.24 15.22 90 top
TP3  -  [Test-Point-0.5mm]  179.23 8.31 90 top
TP4  -  [Test-Point-0.5mm]  175.95 27.47 90 top
TP5  -  [Test-Point-0.5mm]  159.46 63.69 0 top
TP6  -  [Test-Point-0.5mm]  152.4 57.87 90 top
TP7  -  [Test-Point-0.5mm]  152.39 55.07 90 top
TP8  -  [Test-Point-0.5mm]  152.35 53.8 90 top
U1  HD3SS3220RNHT  [WQFN-30_L4.5-W2.5-P0.4-BL-EP]  180.95 40.98 270 top
U2  CH224K  [ESSOP-10_L4.9-W3.9-P1.0-LS6.0-TL-EP]  182.19 11.68 90 top
U3  TPS565201DDCR  [SOT-23-6_L2.9-W1.6-P0.95-LS2.8-BR]  157.12 21.95 180 top
U4  AP2112K-3.3TRG1  [SOT-25-5_L2.9-W1.6-P0.95-LS2.8-BL]  178.84 27.08 90 top
U5  AP2112K-1.8TRG1  [SOT-25_L3.0-W1.6-P0.95-LS2.8-BL]  157.28 64.99 180 top
USB1  U262-241N-4BV64  [USB-C-SMD_TYC-324G]  194.65 36.42 90 top
USB2  U262-241N-4BV64  [USB-C-SMD_TYC-324G]  194 10.39 90 top

## Footprints (pads in the part's own frame, mm; a bottom-side part is the same pattern mirrored in y, then rotated)
C0402
  rect 0.5x0.54 smd: 1(-0.42,0) 2(0.42,0)
C0603
  rect 0.8x0.9 smd: 1(-0.7,0) 2(0.7,0)
CAP-TH_BD8.0-P3.50-D0.5-FD
  round 1.6 hole 1: 1(-1.75,0) 2(1.75,0)
DFN-10_L2.5-W1.0-P0.50-BL-A
  rect 0.2x0.633 smd: 1(-1,-0.411) 2(-0.5,-0.411) 4(0.5,-0.411) 5(1,-0.411) 6(1,0.411) 7(0.5,0.411) 9(-0.5,0.411) 10(-1,0.411)
  rect 0.4x0.633 smd: 3(0,-0.411) 8(0,0.411)
ESSOP-10_L4.9-W3.9-P1.0-LS6.0-TL-EP
  rect 0.6x1.5 smd: 1(-2,-3) 2(-1,-3) 3(0,-3) 4(1,-3) 5(2,-3) 6(2,3) 7(1,3) 8(0,3) 9(-1,3) 10(-2,3)
  rect 3.3x2.1 smd: 11(0,0)
IND-SMD_L4.0-W4.0_YHNR4020
  rect 1.1x3.7 smd: 1(-1.5,0) 2(1.5,0)
LED0603-RD
  rect 0.8x0.8 smd: 1(-0.749,0) 2(0.749,0)
PCIE-SMD_2199230-3_1
  rect 0.3x1.55 smd: 1(-9.25,3.775) 2(-9,-3.775) 3(-8.75,3.775) 4(-8.5,-3.775) 5(-8.25,3.775) 6(-8,-3.775) 7(-7.75,3.775) 8(-7.5,-3.775) 9(-7.25,3.775) 10(-7,-3.775) 11(-6.75,3.775) 20(-4.5,-3.775) 21(-4.25,3.775) 22(-4,-3.775) 23(-3.75,3.775) 24(-3.5,-3.775) 25(-3.25,3.775) 26(-3,-3.775) 27(-2.75,3.775) 28(-2.5,-3.775) 29(-2.25,3.775) 30(-2,-3.775) 31(-1.75,3.775) 32(-1.5,-3.775) 33(-1.25,3.775) 34(-1,-3.775) 35(-0.75,3.775) 36(-0.5,-3.775) 37(-0.25,3.775) 38(0,-3.775) 39(0.25,3.775) 40(0.5,-3.775) 41(0.75,3.775) 42(1,-3.775) 43(1.25,3.775) 44(1.5,-3.775) 45(1.75,3.775) 46(2,-3.775) 47(2.25,3.775) 48(2.5,-3.775) 49(2.75,3.775) 50(3,-3.775) 51(3.25,3.775) 52(3.5,-3.775) 53(3.75,3.775) 54(4,-3.775) 55(4.25,3.775) 56(4.5,-3.775) 57(4.75,3.775) 58(5,-3.775) 59(5.25,3.775) 60(5.5,-3.775) 61(5.75,3.775) 62(6,-3.775) 63(6.25,3.775) 64(6.5,-3.775) 65(6.75,3.775) 66(7,-3.775) 67(7.25,3.775) 68(7.5,-3.775) 69(7.75,3.775) 70(8,-3.775) 71(8.25,3.775) 72(8.5,-3.775) 73(8.75,3.775) 74(9,-3.775) 75(9.25,3.775)
  rect 1.2x2.75 smd: 76(-10.35,3) 77(10.35,3)
R0402
  rect 0.566x0.54 smd: 1(-0.433,0) 2(0.433,0)
R0603
  rect 0.806x0.864 smd: 1(-0.753,0) 2(0.753,0)
R0805
  rect 1.133x1.377 smd: 1(-1,0) 2(1,0)
SIM-SMD_SIM8066-6-1-14-01-A
  rect 0.8x1.14 smd: 1(0.25,6.74) 2(-2.29,6.74) 3(-4.83,6.74) 6(-1.02,6.74) 7(-3.56,6.74)
  rect 0.65x1.14 smd: 5(1.52,6.74) CD(2.47,6.74)
  rect 0.7x2.1 smd: SH1(6.5,5.26) SH2(6.5,-6.74) SH3(-6.5,-6.74) SH4(-6.5,5.26)
SMA_L4.3-W2.6-LS5.2-RD
  rect 2x2 smd: 1(-2.2,0) 2(2.2,0)
SMA_L4.4-W2.6-LS5.0-RD
  rect 1.8x1.7 smd: 1(-2.192,0) 2(2.192,0)
SON-6_L1.5-W1.0-P0.50-TL
  rect 0.35x0.2 smd: 1(-0.275,0.5)
  rect 0.3x0.2 smd: 2(-0.3,0) 3(-0.3,-0.5) 4(0.3,-0.5) 5(0.3,0) 6(0.3,0.5)
SOT-23-6_L2.9-W1.6-P0.95-LS2.8-BR
  rect 1.1x0.6 smd: 1(1.35,-0.95) 2(1.35,0) 3(1.35,0.95) 4(-1.35,0.95) 5(-1.35,0) 6(-1.35,-0.95)
SOT-25-5_L2.9-W1.6-P0.95-LS2.8-BL
  rect 0.623x1.105 smd: 1(-0.95,-1.3) 2(-0.001,-1.3) 3(0.95,-1.3) 4(0.95,1.3) 5(-0.95,1.3)
SOT-25_L3.0-W1.6-P0.95-LS2.8-BL
  rect 0.5x0.9 smd: 1(-0.95,-1.3) 2(0,-1.3) 3(0.95,-1.3) 4(0.95,1.3) 5(-0.95,1.3)
Test-Point-0.5mm
  round 0.5 smd: 1(0,0)
USB-C-SMD_TYC-324G
  oval 1.8x2.2 hole 1.3x1.6: 1(-4.191,1.905) 4(4.191,1.905)
  oval 1.2x2.4 hole 0.6x1.9: 2(-4.32,-2.625) 3(4.32,-2.625)
  rect 0.3x1 smd: A1(-2.625,2.625) A2(-2.125,2.625) A3(-1.625,2.625) A4(-1.125,2.625) A5(-0.625,2.625) A6(-0.125,2.625) A7(0.375,2.625) A8(0.875,2.625) A9(1.375,2.625) A10(1.875,2.625) A11(2.375,2.625) A12(2.875,2.625) B1(2.625,1.275) B2(2.125,1.275) B3(1.625,1.275) B4(1.125,1.275) B5(0.625,1.275) B6(0.125,1.275) B7(-0.375,1.275) B8(-0.875,1.275) B9(-1.375,1.275) B10(-1.875,1.275) B11(-2.375,1.275) B12(-2.875,1.275)
USON-10_L2.5-W1.0-P0.50-BL
  rect 0.2x0.565 smd: 1(-1,-0.4) 2(-0.5,-0.4) 4(0.5,-0.4) 5(1,-0.4) 6(1,0.4) 7(0.5,0.4) 9(-0.5,0.4) 10(-1,0.4)
  rect 0.4x0.565 smd: 3(0,-0.4) 8(0,0.4)
WQFN-30_L4.5-W2.5-P0.4-BL-EP
  custom 0.2x0.5 smd: 1(-1.8,-1.2) 10(1.8,-1.2) 16(1.8,1.2) 25(-1.8,1.2)
  oval 0.2x0.505 smd: 2(-1.4,-1.2) 3(-1,-1.2) 4(-0.6,-1.2) 5(-0.2,-1.2) 6(0.2,-1.2) 7(0.6,-1.2) 8(1,-1.2) 9(1.4,-1.2) 17(1.4,1.2) 18(1,1.2) 19(0.6,1.2) 20(0.2,1.2) 21(-0.2,1.2) 22(-0.6,1.2) 23(-1,1.2) 24(-1.4,1.2)
  custom 0.5x0.2 smd: 11(2.2,-0.8) 15(2.2,0.8) 26(-2.2,0.8) 30(-2.2,-0.8)
  oval 0.505x0.2 smd: 12(2.2,-0.4) 13(2.2,0) 14(2.2,0.4) 27(-2.2,0.4) 28(-2.2,0) 29(-2.2,-0.4)
  rect 3.2x1.2 smd: 31(0,0)

## Nets
+1V8: C13.2 CN1.20 TP5.1 TP7.1 U5.5
+3V3: C8.1 C9.1 C12.1 C16.1 C17.1 C18.1 CN1.2 CN1.4 CN1.24 CN1.38 CN1.68 CN1.70 CN1.72 CN1.74 L1.1 R6.1 R9.1 R10.1 R11.2 U5.1 U5.3
GND: C1.1 C2.2 C3.2 C4.2 C5.2 C6.2 C8.2 C9.2 C10.2 C11.1 C12.2 C13.1 C16.2 C17.2 C18.2 C19.1 C20.1 C21.1 C22.1 CN1.3 CN1.5 CN1.11 CN1.27 CN1.33 CN1.39 CN1.45 CN1.51 CN1.57 CN1.71 CN1.73 CN1.76 CN1.77 D1.3 D1.8 D2.3 D2.8 D3.2 D4.3 D4.8 D5.2 D6.3 D6.8 D7.2 D8.2 LED2.1 R4.1 R7.2 SIM1.5 SIM1.SH1 SIM1.SH2 SIM1.SH3 SIM1.SH4 SIM2.5 SIM2.SH1 SIM2.SH2 SIM2.SH3 SIM2.SH4 TP2.1 U1.3 U1.4 U1.12 U1.13 U1.28 U1.29 U1.31 U2.11 U3.1 U4.2 U5.2 USB1.1 USB1.2 USB1.3 USB1.4 USB1.A1 USB1.A12 USB1.B1 USB1.B12 USB2.1 USB2.2 USB2.3 USB2.4 USB2.A1 USB2.A12 USB2.B1 USB2.B12
VBUS_DATA: C2.1 C10.1 D3.1 R1.1 R12.2 U1.30 U4.1 U4.3 USB1.A4 USB1.A9 USB1.B4 USB1.B9
VBUS_PD: C4.1 C5.1 C6.1 D5.1 R2.1 R3.1 R8.1 TP1.1 U3.3 USB2.A4 USB2.A9 USB2.B4 USB2.B9
VBUS_SNS_224: R3.2 U2.8
VDD_224: C3.1 R2.2 R5.2 U2.1
EN_BUCK: R8.2 U3.5
FB_BUCK: R6.2 R7.1 U3.4
PG_224: R5.1 TP3.1 U2.10
SSRX1_N: D4.2 D4.9 U1.15 USB1.B10
SSRX1_P: D4.1 D4.10 U1.14 USB1.B11
SSRX2_N: D1.1 D1.10 U1.18 USB1.A10
SSRX2_P: D1.2 D1.9 U1.19 USB1.A11
SSRX_N_A: C14.1 U1.7
SSRX_P_A: C15.1 U1.6
SSTX1_N: D4.5 D4.6 U1.17 USB1.A3
SSTX1_P: D4.4 D4.7 U1.16 USB1.A2
SSTX2_N: D1.4 D1.7 U1.20 USB1.B3
SSTX2_P: D1.5 D1.6 U1.21 USB1.B2
USB1_CC1: D2.2 D2.9 U1.2 USB1.A5
USB1_CC2: D2.1 D2.10 U1.1 USB1.B5
USB2_CC1: U2.7 USB2.A5
USB2_CC2: U2.6 USB2.B5
USB2_DM: CN1.9 D2.5 D2.6 R16.1 R16.2 USB1.A7 USB1.B7
USB2_DP: CN1.7 D2.4 D2.7 R15.1 R15.2 USB1.A6 USB1.B6
USB3_RXM: C14.2 CN1.35 D6.2 D6.9
USB3_RXP: C15.2 CN1.37 D6.1 D6.10
USB3_TXM: CN1.29 D6.5 D6.6 U1.9
USB3_TXP: CN1.31 D6.4 D6.7 U1.10
USIM1_CLK: CN1.32 D7.3 SIM1.3
USIM1_DATA: CN1.34 D7.6 R13.2 SIM1.7
USIM1_PWR: C19.2 C20.2 CN1.36 D7.5 R13.1 SIM1.1
USIM1_RST: CN1.30 D7.1 SIM1.2
USIM2_CLK: CN1.44 D8.3 SIM2.3
USIM2_DATA: CN1.42 D8.6 R14.2 SIM2.7
USIM2_PWR: C21.2 C22.2 CN1.48 D8.5 R14.1 SIM2.1
USIM2_RST: CN1.46 D8.1 SIM2.2
WWAN_LED_N: CN1.10 LED1.1
$1N43: C7.2 U3.6
$1N75: C1.2 C11.2 TP4.1 U1.8 U4.5
$1N104: CN1.22 R12.1 TP8.1
$1N134: LED2.2 R10.2
$1N175: LED1.2 R9.2
$1N255: CN1.6 R11.1 TP6.1
$1N366: R1.2 U1.5
$1N416: R4.2 U2.9
$1N418: C7.1 L1.2 U3.2

Pads without a net: CN1 1 8 21 23 25 26 28 40 41 43 47 49 50 52 53 54 55 56 58 59 60 61 62 63 64 65 66 67 69 75; D7 4; D8 4; SIM1 6 CD; SIM2 6 CD; U1 11 22 23 24 25 26 27; U2 2 3 4 5; U4 4; U5 4; USB1 A8 B8; USB2 A2 A3 A6 A7 A8 A10 A11 B2 B3 B6 B7 B8 B10 B11

## Copper pours and planes (outline as drawn; the poured copper is in the pictures)
GND on Top Layer: -66.37,48.48 100.19,215.03 273.35,41.87 106.79,-124.69
GND on Bottom Layer: -81.8,48.54 96.06,226.4 280.85,41.62 102.98,-136.25
GND on Inner2: 127.37,9.96 241.02,9.96 241.02,-60.69 127.37,-60.69
